# Altium schematic sheet sch-split-flap-ctl.SchDoc
size A4
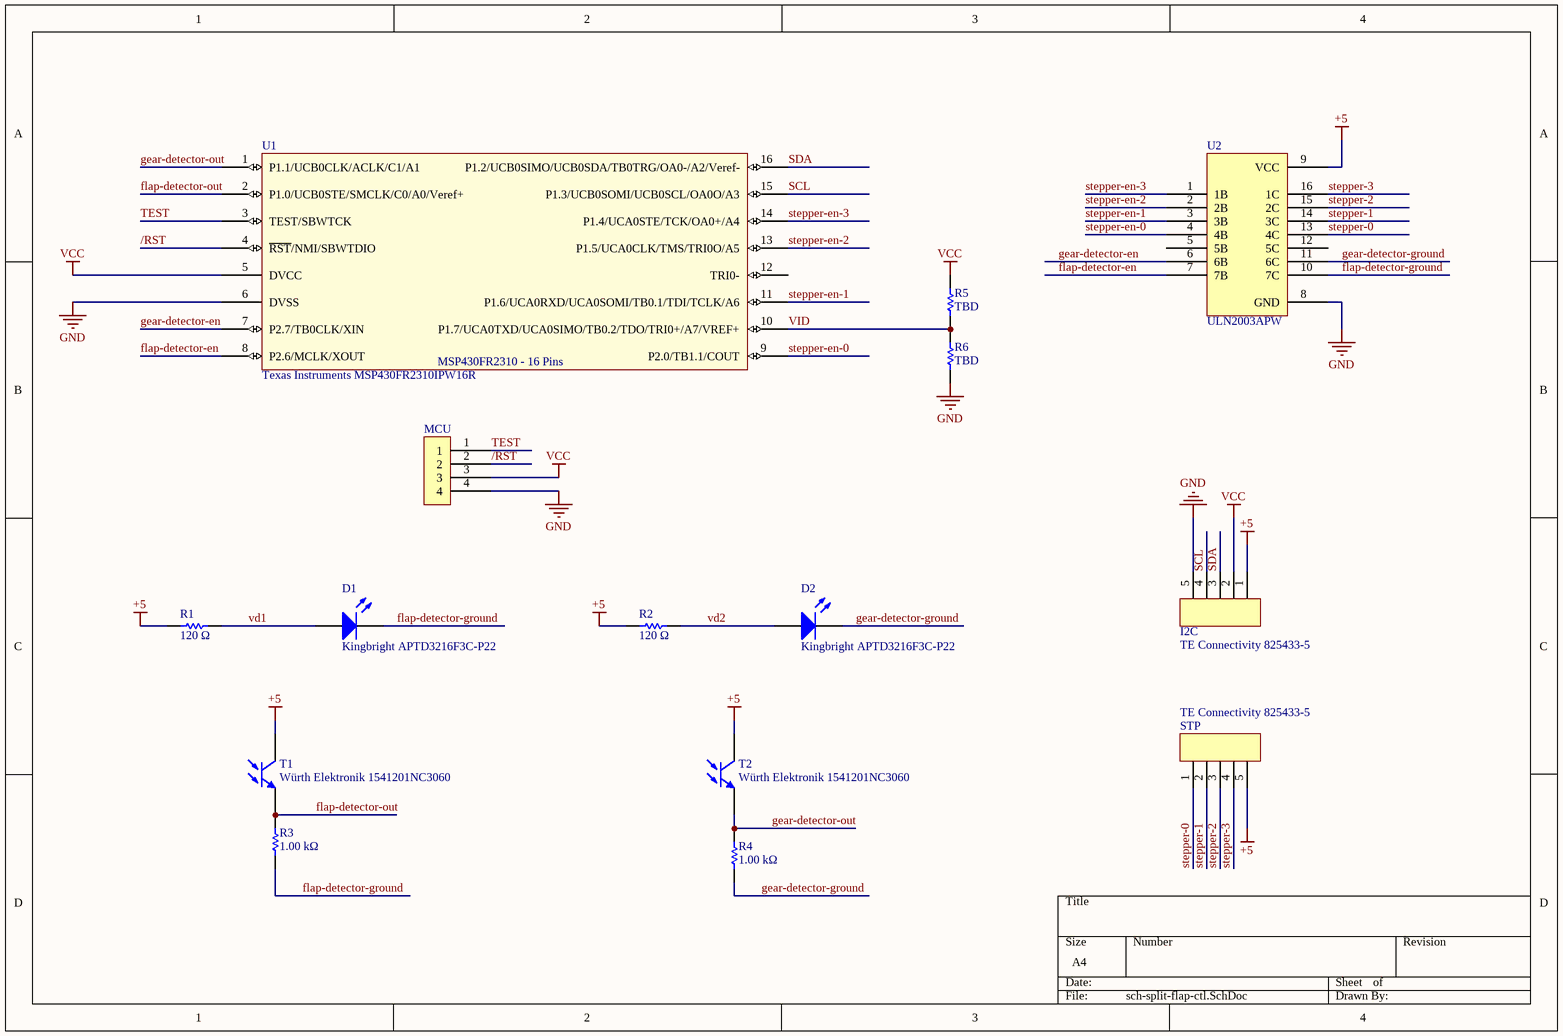
[diagram p0: sch-split-flap-ctl.SchDoc]

## Parts
D1  Kingbright APTD3216F3C-P22  [PCB-jai4cqehynyl4ftrhjru-1]
D2  Kingbright APTD3216F3C-P22  [PCB-jai4cqehynyl4ftrhjru-1]
I2C  TE Connectivity 825433-5  [PCB-xti7u9j93a3qzo3mq4li-1]
MCU  TE Connectivity / AMP 5-520314-4  [PCB-2e32bpzlb7s96t5zrzh4-1]  (value not drawn)
R1  120 Ω  [PCB-2ox8asr4tk2mzt0c5jnj-1]
R2  120 Ω  [PCB-2ox8asr4tk2mzt0c5jnj-1]
R3  1.00 kΩ  [PCB-2ox8asr4tk2mzt0c5jnj-1]
R4  1.00 kΩ  [PCB-2ox8asr4tk2mzt0c5jnj-1]
R5  TBD  [PCB-2ox8asr4tk2mzt0c5jnj-1]
R6  TBD  [PCB-2ox8asr4tk2mzt0c5jnj-1]
STP  TE Connectivity 825433-5  [PCB-xti7u9j93a3qzo3mq4li-1]
T1  Würth Elektronik 1541201NC3060  [PCB-is2cv6u2mp8dz7t5ytba-1]
T2  Würth Elektronik 1541201NC3060  [PCB-is2cv6u2mp8dz7t5ytba-1]
U1  Texas Instruments MSP430FR2310IPW16R  [TSSOP16]
U2  ULN2003APW  [PCB-o079r3vxg80uk6bdh2cv-1]

## Nets
+5: I2C.1 R1.2 R2.2 STP.5 T1.1(C) T2.1(C) U2.9(VCC)
GND: I2C.5 MCU.4 R6.1 U1.6(DVSS) U2.8(GND)
VCC: I2C.2 MCU.3 R5.2 U1.5(DVCC)
/RST: MCU.2 U1.4(~{RST}/NMI/SBWTDIO)
flap-detector-en: U1.8(P2.6/MCLK/XOUT) U2.7(7B)
flap-detector-ground: D1.2(K) R3.1 U2.10(7C)
flap-detector-out: R3.2 T1.2(E) U1.2(P1.0/UCB0STE/SMCLK/C0/A0/Veref+)
gear-detector-en: U1.7(P2.7/TB0CLK/XIN) U2.6(6B)
gear-detector-ground: D2.2(K) R4.1 U2.11(6C)
gear-detector-out: R4.2 T2.2(E) U1.1(P1.1/UCB0CLK/ACLK/C1/A1)
SCL: I2C.4 U1.15(P1.3/UCB0SOMI/UCB0SCL/OA0O/A3)
SDA: I2C.3 U1.16(P1.2/UCB0SIMO/UCB0SDA/TB0TRG/OA0-/A2/Veref-)
stepper-0: STP.1 U2.13(4C)
stepper-1: STP.2 U2.14(3C)
stepper-2: STP.3 U2.15(2C)
stepper-3: STP.4 U2.16(1C)
stepper-en-0: U1.9(P2.0/TB1.1/COUT) U2.4(4B)
stepper-en-1: U1.11(P1.6/UCA0RXD/UCA0SOMI/TB0.1/TDI/TCLK/A6) U2.3(3B)
stepper-en-2: U1.13(P1.5/UCA0CLK/TMS/TRI0O/A5) U2.2(2B)
stepper-en-3: U1.14(P1.4/UCA0STE/TCK/OA0+/A4) U2.1(1B)
TEST: MCU.1 U1.3(TEST/SBWTCK)
vd1: D1.1(A) R1.1
vd2: D2.1(A) R2.1
VID: R5.1 R6.2 U1.10(P1.7/UCA0TXD/UCA0SIMO/TB0.2/TDO/TRI0+/A7/VREF+)

Not connected (* = marked no-connect by the designer): U1 12(TRI0-); U2 5(5B) 12(5C)

## Notes on the sheet
- (in symbol CMP-7ebab38f542ba17d-1) MSP430FR2310 - 16 Pins

## Library data of the parts
D1 D2 = CMP-ec9320fff9353354-1: Infrared Emitters 3.2x1.6mm IR SMD LED; Octopart URL: https://octopart.com/aptd3216f3c-p22-kingbright-90583232; Manufacturer Part Number: APTD3216F3C-P22; OctopartID: ec9320fff9353354
I2C STP = CMP-a17c6af386817ebb-12: Conn Unshrouded Header HDR 5 POS 2.54mm Solder ST Thru-Hole
MCU = CMP-5c1097d27ab083d7-7: Wire-To-Board Connector, AMPMODU Mod II Series, Through Hole, Header, 4, 2.54 mm; Pin Pitch: 2.54 mm; Gender: Male; Number of Contacts: 4; ELV Compliant: Compliant; Lead-Free Status: Lead Free; Current Rating: 3.00 A; Mounting Style: PCB; Octopart URL: http://octopart.com/826926-4-te+connectivity-46662598; Flammability Rating: UL 94 V-0; Lifecycle Status: Active; Contact Plating: Tin; REACH SVHC Compliance: No SVHC; Orientation: Vertical; OctopartID: 5c1097d27ab083d7; Contact Material: Phosphor Bronze; Color: Green
R1-R6 = CMP-9c8b5704b0ee434c-2: Surface Mount Chip Resistor, Thin Film, RT Series, 1 kohm, 100 mW, 1%, 75 V, 0603 [1608 Metric]; Manufacturer Part Number: RT0603FRE071KL; Case/Package (SI): 1608; Lead-Free Status: Lead Free; Power Rating: 100 mW; Voltage Rating (DC): 75.0 V; Resistance: 1.00 k?; Size-Length: 1.60 mm; OctopartID: 9c8b5704b0ee434c; REACH SVHC Compliance: No SVHC; RoHS: Compliant; Packaging: Tape & Reel; Case/Package: 0603; Mounting Style: Surface Mount; Size-Height: 450 µm; Size-Width: 800 µm; Resistance Tolerance: ±1%; Number of Pins: 2; Octopart URL: http://octopart.com/rt0603fre071kl-yageo-42273027
T1 T2 = CMP-6c97a07c92ddb350-2: Photo Transistor, NPN, 940NM, 1206
U1 = CMP-7ebab38f542ba17d-1: 16 MHz Ultra-Low-Power Microcontroller - 2 KB FRAM, 1 KB SRAM, 16 IO, 8ch 10-bit ADC, OpAmp, TIA 16-TSSOP -40 to 85; Clock Speed: 16.0 MHz; Lead-Free Status: Contains Lead; Number of UARTs: 1; RAM Memory Size: 3072 B; Octopart URL: https://octopart.com/msp430fr2310ipw16r-texas+instruments-71241719; Manufacturer Part Number: MSP430FR2310IPW16R; Case/Package: TSSOP; Frequency: 16.0 MHz; Lifecycle Status: Pre-Release; Operating Temperature: -40.0 °C to 85.0 °C; Number of Pins: 16; RoHS: Compliant; OctopartID: 7ebab38f542ba17d
U2 = ULN2003APW: Darlington Transistor Array; Lead-Free Status: Lead Free; Polarity: NPN; Number of Pins: 16; OctopartID: 83444a22d3b75c83; Mounting Style: Surface Mount; Octopart URL: http://octopart.com/uln2003apw-texas+instruments-7107989; Case/Package: TSSOP; Packaging: Tube; RoHS: Compliant; Lifecycle Status: Active; REACH SVHC Compliance: No SVHC